# Altium schematic sheet ESP32_CONTROLLER_SHEET.SchDoc
size A4; SheetNumber: 4; SheetTotal: 8
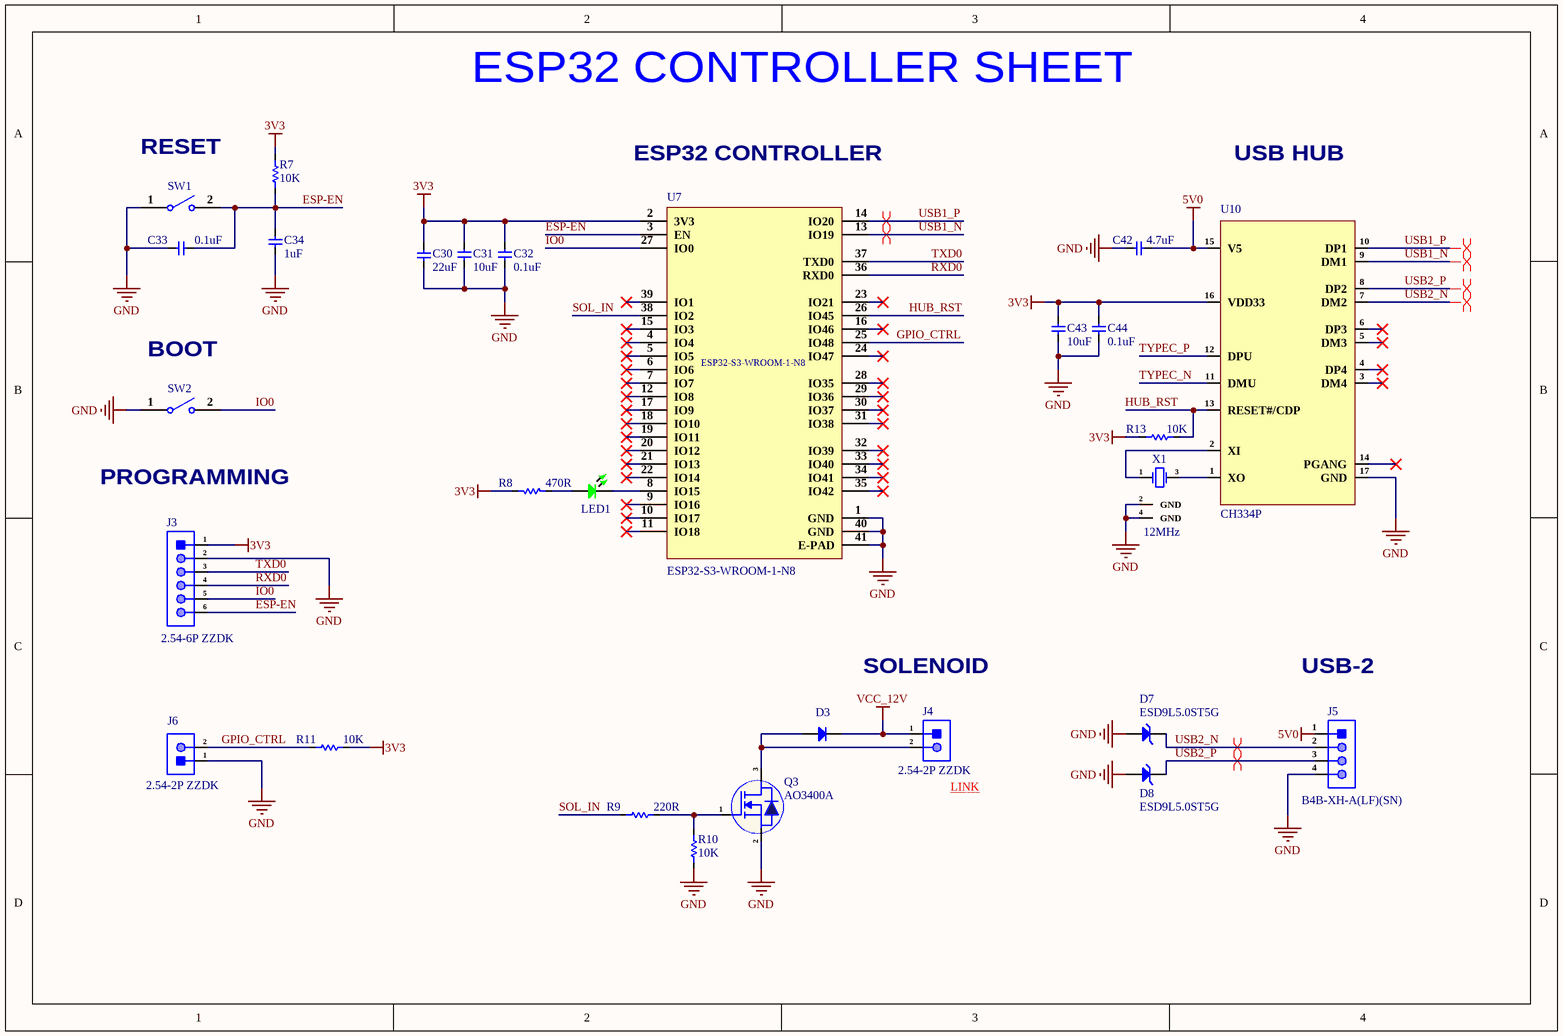
[diagram p0: ESP32_CONTROLLER_SHEET.SchDoc]

## Parts
C30  22uF  [Cap-0603]
C31  10uF  [Cap-0603]
C32  0.1uF  [Cap-0402]
C33  0.1uF  [Cap-0402]
C34  1uF  [Cap-0402]
C42  4.7uF  [Cap-0402]
C43  10uF  [Cap-0603]
C44  0.1uF  [Cap-0402]
D3  1N4148W  [SOD-123]  (value not drawn)
D7  ESD9L5.0ST5G  [SOD-923.]
D8  ESD9L5.0ST5G  [SOD-923.]
J3  2.54-6P ZZDK  [2.54-6P ZZDK]
J4  2.54-2P ZZDK  [2.54-2P ZZDK]
J5  B4B-XH-A(LF)(SN)  [B4B-XH-A(LF)(SN).]
J6  2.54-2P ZZDK  [2.54-2P ZZDK]
LED1  Emerald  [LED-0603]  (value not drawn)
Q3  AO3400A  [sot-23]
R7  10K  [Res-0402]
R8  470R  [Res-0402]
R9  220R  [Res-0402]
R10  10K  [Res-0402]
R11  10K  [Res-0402]
R13  10K  [Res-0402]
SW1  GT-TC032A-H015-L1  [GT-TC032A-H015-L1]  (value not drawn)
SW2  GT-TC032A-H015-L1  [GT-TC032A-H015-L1]  (value not drawn)
U7  ESP32-S3-WROOM-1-N8  [41-SMD Module]
U10  CH334P  [QFN-16]
X1  12MHz  [SMD2520-4P]

## Nets
3V3: C30.2 C31.1 C32.1 C43.1 C44.1 J3.1 R7.2 R8.2 R11.2 R13.2 U7.2(3V3) U10.16(VDD33)
5V0: C42.2 J5.1 U10.15(V5)
GND: C30.1 C31.2 C32.2 C33.2 C34.1 C42.1 C43.2 C44.2 D7.2(A) D8.2(A) J3.2 J5.4 J6.1 Q3.2(S) R10.1 SW1.1 SW2.1 U7.1(GND) U7.40(GND) U7.41(E-PAD) U10.17(GND) X1.2(GND) X1.4(GND)
VCC_12V: D3.2(K) J4.1
ESP-EN: C33.1 C34.2 J3.6 R7.1 SW1.2 U7.3(EN)
GPIO_CTRL: J6.2 R11.1 U7.25(IO48)
HUB_RST: R13.1 U7.26(IO45) U10.13(RESET#/CDP)
IO0: J3.5 SW2.2 U7.27(IO0)
RXD0: J3.4 U7.36(RXD0)
SOL_IN: R9.1 U7.38(IO2)
TXD0: J3.3 U7.37(TXD0)
TYPEC_N: U10.11(DMU)
TYPEC_P: U10.12(DPU)
USB1_N: U7.13(IO19) U10.9(DM1)
USB1_P: U7.14(IO20) U10.10(DP1)
USB2_N: D7.1(K) J5.2 U10.7(DM2)
USB2_P: D8.1(K) J5.3 U10.8(DP2)
NetD3_1: D3.1(A) J4.2 Q3.3(D)
NetLED1_1: LED1.1 R8.1
NetLED1_2: LED1.2 U7.8(IO15)
NetQ3_1: Q3.1(G) R9.2 R10.2
NetU10_1: U10.1(XO) X1.3(OSC2)
NetU10_2: U10.2(XI) X1.1(OSC1)

Not connected (* = marked no-connect by the designer): U7 4(IO4)* 5(IO5)* 6(IO6)* 7(IO7)* 9(IO16)* 10(IO17)* 11(IO18)* 12(IO8)* 15(IO3)* 16(IO46)* 17(IO9)* 18(IO10)* 19(IO11)* 20(IO12)* 21(IO13)* 22(IO14)* 23(IO21)* 24(IO47)* 28(IO35)* 29(IO36)* 30(IO37)* 31(IO38)* 32(IO39)* 33(IO40)* 34(IO41)* 35(IO42)* 39(IO1)*; U10 3(DM4)* 4(DP4)* 5(DM3)* 6(DP3)* 14(PGANG)*

## Layout directives
differential pair; differential pair class USB: USB1_N, USB1_P, USB2_N, USB2_P

## Notes on the sheet
- ESP32 CONTROLLER SHEET
- (near SW1) RESET
- ESP32 CONTROLLER
- USB HUB
- (near SW2) BOOT
- PROGRAMMING
- SOLENOID
- USB-2
- (near J4) LINK <https://www.digikey.com/en/products/detail/adafruit-industries-llc/5065/15189157?s=N4IgTCBcDaIM4FsCGAbFACAjGAauuA9igKYB2BAlgCYgC6AvkA>

## Library data of the parts
C30 = CC0603MRX5R6BB226: CAP CER 22UF 10V X5R 0603; Manufacturer: Yageo; Tolerance: 20%; Item Type: Capacitor; Supplier 1: Digi-Key; Manufacturer Part Number: CC0603MRX5R6BB226; RoHS: Yes; Category: Ceramic Capacitors; Stock 1: 19628; Pricing 1: 1=0.68000, 10=0.48000, 50=0.36300, 100=0.31610, 500=0.23416, 1000=0.19903 (USD); Mount: Surface Mount; Case/Package: 0603; Case Code (Metric): 1608; Case Code (Imperial): 0603; Weight: 7.1E-05oz; Min Operating Temperature: -55°C; Max Operating Temperature: 85°C; Packaging: Tape and Reel; Capacitance: 22uF; Voltage Rating: 10V; Dielectric: X5R; Termination: SMD/SMT; Voltage Rating (DC): 10V; Package Quantity: 4000; Length: 0.063inch; Width: 0.8mm; Height: 0.8mm; Thickness: 0.035inch; Lead Free: Lead Free; Halogen Free: Halogen Free; RoHS Compliant: Yes; ComponentLink1URL: http://www.mouser.com/ds/2/447/Yageo_UPY-GP_NP0_16V-to-50V_9-358835.pdf?src-supplier=Mouser; ComponentLink1Description: http://www.mouser.com/ds/2/447/Yageo_UPY-GP_NP0_16V-to-50V_9-358835.pdf?src-supplier=Mouser; ComponentLink2URL: http://www.yageo.com/documents/recent/UPY-GPHC_X5R_4V-to-50V_25.pdf?src-supplier=Digi-Key; ComponentLink2Description: http://www.yageo.com/documents/recent/UPY-GPHC_X5R_4V-to-50V_25.pdf?src-supplier=Digi-Key; Supplier Part Number 1: 311-1819-1-ND; LCSC Part Number: C109447
C31 C43 = CC0603KRX5R7BB106: CAP CER 10UF 16V X5R 0603; Manufacturer: Yageo; Tolerance: 10%; Item Type: Capacitor; Supplier 1: Digi-Key; Manufacturer Part Number: CC0603KRX5R7BB106; RoHS: Yes; Category: Ceramic Capacitors; Stock 1: 240725; Pricing 1: 1=0.68000, 10=0.48000, 50=0.36300, 100=0.31610, 500=0.23416, 1000=0.19903 (USD); Mount: Surface Mount; Case/Package: 0603; Case Code (Metric): 1608; Case Code (Imperial): 0603; Min Operating Temperature: -55°C; Max Operating Temperature: 85°C; Packaging: Cut Tape; Capacitance: 10uF; Voltage Rating: 16V; RoHS Compliant: Yes; ComponentLink1URL: http://www.yageo.com/documents/recent/UPY-GPHC_X5R_4V-to-50V_25.pdf?src-supplier=Digi-Key; ComponentLink1Description: http://www.yageo.com/documents/recent/UPY-GPHC_X5R_4V-to-50V_25.pdf?src-supplier=Digi-Key; Supplier Part Number 1: 311-3486-1-ND; LCSC Part Number: C2936601
C32 C33 C44 = CL05B104KB54PNC: CAP CER 0.1UF 50V X7R 0402; Manufacturer: Samsung; Supplier 1: Digi-Key; Manufacturer Part Number: CL05B104KB54PNC; Stock 1: 8594; Pricing 1: 1=0.1, 10=0.067, 50=0.0366, 100=0.0299, 500=0.02138, 1000=0.01681, 2500=0.01528, 5000=0.01406 (USD); Supplier Part Number 1: 1276-CL05B104KB54PNCDKR-ND; LCSC Part Number: C307331
C34 = CC0402KRX5R7BB105: CAP CER 1UF 16V X5R 0402; Manufacturer: Yageo; Tolerance: 10%; Item Type: Capacitor; Supplier 1: Digi-Key; Manufacturer Part Number: CC0402KRX5R7BB105; Stock 1: 1405667; Pricing 1: 1=0.36, 10=0.252, 100=0.1512, 500=0.1134, 1000=0.09576, 2500=0.09072, 5000=0.08568 (USD); Mount: Surface Mount; Case/Package: 0402; Weight: 2.3E-05oz; Case Code (Imperial): 0402; Case Code (Metric): 1005; Min Operating Temperature: -55°C; Max Operating Temperature: 85°C; Capacitance: 1uF; Dielectric: X5R; Packaging: Tape and Reel; Voltage Rating (DC): 16V; Voltage Rating: 16V; Termination: SMD/SMT; Composition: Ceramic; Length: 1mm; Height: 0.5mm; Width: 0.02inch; Thickness: 0.022inch; Depth: 0.5mm; Radiation Hardening: No; Lead Free: Lead Free; Halogen Free: Halogen Free; ComponentLink1URL: http://www.yageo.com/documents/recent/UPY-GPHC_X5R_4V-to-50V_12.pdf?src-supplier=Avnet+Europe; ComponentLink1Description: http://www.yageo.com/documents/recent/UPY-GPHC_X5R_4V-to-50V_12.pdf?src-supplier=Avnet+Europe; Supplier Part Number 1: 311-1691-6-ND; LCSC Part Number: C325464
C42 = CL05A475MO5NUNC: CAP CER 4.7UF 16V X5R 0402; Manufacturer: Samsung; Material: 4241ConductorMaterial; Tolerance: 20%; Supplier 1: Avnet; Manufacturer Part Number: CL05A475MO5NUNC; RoHS: Yes; Category: Ceramic Capacitors; Stock 1: 50000; Pricing 1: 10000=0.09712 (USD); Mount: Surface Mount; Case/Package: 0402; Case Code (Metric): 1005; Case Code (Imperial): 0402; Min Operating Temperature: -55°C; Max Operating Temperature: 85°C; Packaging: Cut Tape; Capacitance: 4.7uF; Voltage Rating: 16V; Series: CL; Voltage Rating (DC): 16V; Length: 0.039inch; Width: 0.02inch; Height: 550um; Thickness: 0.022inch; RoHS Compliant: Yes; ComponentLink1URL: http://www.farnell.com/datasheets/2710653.pdf?src-supplier=Farnell; ComponentLink1Description: http://www.farnell.com/datasheets/2710653.pdf?src-supplier=Farnell; ComponentLink2URL: http://www.samsungsem.com/kr/support/product-search/mlcc/CL05A475MO5NUNC.jsp?src-supplier=Digikey; ComponentLink2Description: http://www.samsungsem.com/kr/support/product-search/mlcc/CL05A475MO5NUNC.jsp?src-supplier=Digikey; ComponentLink3URL: http://www.farnell.com/datasheets/2710653.pdf?src-supplier=Element14; ComponentLink3Description: http://www.farnell.com/datasheets/2710653.pdf?src-supplier=Element14; ComponentLink4URL: https://datasheet.octopart.com/CL05A475MO5NUNC-Samsung-Electro-Mechanics-datasheet-123102911.pdf?src-supplier=Future+Electronics; ComponentLink4Description: https://datasheet.octopart.com/CL05A475MO5NUNC-Samsung-Electro-Mechanics-datasheet-123102911.pdf?src-supplier=Future+Electronics; ComponentLink5URL: http://www.farnell.com/datasheets/2710653.pdf?src-supplier=Newark; ComponentLink5Description: http://www.farnell.com/datasheets/2710653.pdf?src-supplier=Newark; Supplier Part Number 1: CL05A475MO5NUNC
D3 = 1N4148W: 100V 400mW Single 1.25V@150mA 8ns 300mA SOD-123 Switching Diode ROHS; Manufacturer: JSMSEMI; ComponentLink1Description: LCSC; ComponentLink1URL: https://www.lcsc.com/product-detail/Switching-Diode_JSMSEMI-1N4148W_C917030.html; Manufacturer Part Number: 1N4148W; Package: SOD-123; LCSC Part Number: C917030; Item Type: Diode
D7 = ESD9L5.0ST5G: Manufacturer: ON Semiconductor; Capacitance: 0.9pF; Direction: Unidirectional; Clamping Voltage: 9.8V; Number of Unidirectional Channels: 1; Reverse Standoff Voltage: 5V; Min Breakdown Voltage: 5.4V; Power Line Protection: No; Leakage Current: 1uA; Element Configuration: Single; Peak Pulse Current: 1A; Diode Type: ZENER; Reverse Breakdown Voltage: 5.8V; Peak Pulse Power: 150mW; ESD Protection: Yes; Test Current: 1mA; Supplier 1: Digi-Key; Manufacturer Part Number: ESD9L5.0ST5G; RoHS: Yes; Category: ESD and Circuit Protection ICs; Stock 1: 558996; Pricing 1: 1=0.37000, 10=0.25600, 100=0.12500, 500=0.10426, 1000=0.07244, 2000=0.06278 (USD); Case/Package: SOD-923-2; Number of Pins: 2; Contact Plating: Tin,Matte; Min Operating Temperature: -55°C; Max Operating Temperature: 150°C; Package Quantity: 1; Packaging: Tape and Reel; Working Voltage: 5V; Resistor Type: Zener; Series: Automotive, AEC-Q101; Number of Elements: 1; Operating Supply Voltage: 5V; Max Surge Current: 1A; Breakdown Voltage: 5.4V; Number of Channels: 1; Polarity: Unidirectional; Termination: SMD/SMT; Max Reverse Leakage Current: 1uA; Max Breakdown Voltage: 5.4V; Number of Lines: 1; Power Dissipation: 150mW; Clamping Voltage-Max: 9.8V; Length: 0.8mm; Width: 0.65mm; Height: 0.4mm; Depth: 0.6mm; Radiation Hardening: No; Lead Free: Lead Free; RoHS Compliant: Yes; REACH SVHC: No SVHC; Halogen Free: Halogen Free; ComponentLink1URL: https://datasheet.ciiva.com/15143/getdatasheetpartid-185186-15143896.pdf?src-supplier=Verical; ComponentLink1Description: https://datasheet.ciiva.com/15143/getdatasheetpartid-185186-15143896.pdf?src-supplier=Verical; ComponentLink2URL: https://datasheet.ciiva.com/4510/esd9l-d-4510647.pdf?src-supplier=Mouser; ComponentLink2Description: https://datasheet.ciiva.com/4510/esd9l-d-4510647.pdf?src-supplier=Mouser; ComponentLink3URL: https://datasheet.ciiva.com/3304/esd9l-d-3304011.pdf?src-supplier=Avnet; ComponentLink3Description: https://datasheet.ciiva.com/3304/esd9l-d-3304011.pdf?src-supplier=Avnet; ComponentLink4URL: https://datasheet.ciiva.com/16437/esd9l-d-16437835.pdf?src-supplier=Future+Electronics; ComponentLink4Description: https://datasheet.ciiva.com/16437/esd9l-d-16437835.pdf?src-supplier=Future+Electronics; ComponentLink5URL: https://datasheet.ciiva.com/339/esd9l-d-339853.pdf?src-supplier=Digi-Key; ComponentLink5Description: https://datasheet.ciiva.com/339/esd9l-d-339853.pdf?src-supplier=Digi-Key; ComponentLink6URL: https://datasheet.ciiva.com/339/esd9l-d-339854.pdf?src-supplier=Digi-Key; ComponentLink6Description: https://datasheet.ciiva.com/339/esd9l-d-339854.pdf?src-supplier=Digi-Key; ComponentLink7URL: https://datasheet.ciiva.com/11195/esd9l-d-11195342.pdf?src-supplier=Avnet; ComponentLink7Description: https://datasheet.ciiva.com/11195/esd9l-d-11195342.pdf?src-supplier=Avnet; ComponentLink8URL: https://datasheet.ciiva.com/25958/esd9l-d-25958446.pdf?src-supplier=Avnet+Europe; ComponentLink8Description: https://datasheet.ciiva.com/25958/esd9l-d-25958446.pdf?src-supplier=Avnet+Europe; ComponentLink9URL: https://datasheet.ciiva.com/339/esd9l-d-339855.pdf?src-supplier=Digi-Key; ComponentLink9Description: https://datasheet.ciiva.com/339/esd9l-d-339855.pdf?src-supplier=Digi-Key; Supplier Part Number 1: ESD9L5.0ST5GOSCT-ND; LCSC Part Number: C82326
D8 = ESD9L5.0ST5G: TVS DIODE 5V 9.8V SOD923; Manufacturer: ON Semiconductor; Capacitance: 0.9pF; Direction: Unidirectional; Number of Unidirectional Channels: 1; Min Breakdown Voltage: 5.4V; Power Line Protection: No; Leakage Current: 1uA; Element Configuration: Single; Peak Pulse Current: 1A; Diode Type: ZENER; Reverse Breakdown Voltage: 5.8V; Peak Pulse Power: 150mW; ESD Protection: Yes; Test Current: 1mA; Supplier 1: Digi-Key; Manufacturer Part Number: ESD9L5.0ST5G; RoHS: Yes; Category: ESD and Circuit Protection ICs; Stock 1: 558996; Pricing 1: 1=0.37000, 10=0.25600, 100=0.12500, 500=0.10426, 1000=0.07244, 2000=0.06278 (USD); Case/Package: SOD-923-2; Number of Pins: 2; Contact Plating: Tin,Matte; Min Operating Temperature: -55°C; Max Operating Temperature: 150°C; Package Quantity: 1; Packaging: Tape and Reel; Clamping Voltage: 9.8V; Reverse Standoff Voltage: 5V; Working Voltage: 5V; Resistor Type: Zener; Series: Automotive, AEC-Q101; Number of Elements: 1; Operating Supply Voltage: 5V; Max Surge Current: 1A; Breakdown Voltage: 5.4V; Number of Channels: 1; Polarity: Unidirectional; Termination: SMD/SMT; Max Reverse Leakage Current: 1uA; Max Breakdown Voltage: 5.4V; Number of Lines: 1; Power Dissipation: 150mW; Clamping Voltage-Max: 9.8V; Length: 0.8mm; Width: 0.65mm; Height: 0.4mm; Depth: 0.6mm; Radiation Hardening: No; Lead Free: Lead Free; RoHS Compliant: Yes; REACH SVHC: No SVHC; Halogen Free: Halogen Free; ComponentLink1URL: https://datasheet.ciiva.com/15143/getdatasheetpartid-185186-15143896.pdf?src-supplier=Verical; ComponentLink1Description: https://datasheet.ciiva.com/15143/getdatasheetpartid-185186-15143896.pdf?src-supplier=Verical; ComponentLink2URL: https://datasheet.ciiva.com/4510/esd9l-d-4510647.pdf?src-supplier=Mouser; ComponentLink2Description: https://datasheet.ciiva.com/4510/esd9l-d-4510647.pdf?src-supplier=Mouser; ComponentLink3URL: https://datasheet.ciiva.com/3304/esd9l-d-3304011.pdf?src-supplier=Avnet; ComponentLink3Description: https://datasheet.ciiva.com/3304/esd9l-d-3304011.pdf?src-supplier=Avnet; ComponentLink4URL: https://datasheet.ciiva.com/16437/esd9l-d-16437835.pdf?src-supplier=Future+Electronics; ComponentLink4Description: https://datasheet.ciiva.com/16437/esd9l-d-16437835.pdf?src-supplier=Future+Electronics; ComponentLink5URL: https://datasheet.ciiva.com/339/esd9l-d-339853.pdf?src-supplier=Digi-Key; ComponentLink5Description: https://datasheet.ciiva.com/339/esd9l-d-339853.pdf?src-supplier=Digi-Key; ComponentLink6URL: https://datasheet.ciiva.com/339/esd9l-d-339854.pdf?src-supplier=Digi-Key; ComponentLink6Description: https://datasheet.ciiva.com/339/esd9l-d-339854.pdf?src-supplier=Digi-Key; ComponentLink7URL: https://datasheet.ciiva.com/11195/esd9l-d-11195342.pdf?src-supplier=Avnet; ComponentLink7Description: https://datasheet.ciiva.com/11195/esd9l-d-11195342.pdf?src-supplier=Avnet; ComponentLink8URL: https://datasheet.ciiva.com/25958/esd9l-d-25958446.pdf?src-supplier=Avnet+Europe; ComponentLink8Description: https://datasheet.ciiva.com/25958/esd9l-d-25958446.pdf?src-supplier=Avnet+Europe; ComponentLink9URL: https://datasheet.ciiva.com/339/esd9l-d-339855.pdf?src-supplier=Digi-Key; ComponentLink9Description: https://datasheet.ciiva.com/339/esd9l-d-339855.pdf?src-supplier=Digi-Key; Supplier Part Number 1: ESD9L5.0ST5GOSCT-ND; LCSC Part Number: C82326
J3 = 2.54-6P ZZDK: CONN HEADER TH 6POS 2.5mm; Manufacturer: SHOU HAN; Manufacturer Part Number: 2.54-6P ZZDK; LCSC Part Number: C18185653
J4 J6 = 2.54-2P ZZDK: 1x2P 2P XH 1 2.5mm Tin 2 -25℃~+85℃ Brass 3A Direct Insert Plugin,P=2.5mm Wire To Board Connector ROHS; Manufacturer: SHOU HAN; Manufacturer Part Number: 2.54-2P ZZDK; Package: Plugin,P=2.5mm; LCSC Part Number: C18185649; Item Type: Wire To Board Connector; ComponentLink1Description: LCSC; ComponentLink1URL: https://www.lcsc.com/product-detail/Wire-To-Board-Connector_SHOU-HAN-2-54-2P-ZZDK_C18185649.html
J5 = B4B-XH-A(LF)(SN): CONN HEADER VERT 4POS 2.5MM; Manufacturer: JST; Current Rating: 3A; Gender: Male; Contact Resistance: 20mR; Voltage Rating (AC): 250V; Connector Type: Male Pin; Number of Positions: 4; Insulation Resistance: 1GR; Wire/Cable Gauge: 22AWG; Item Type: JST Connector; Supplier 1: Future Electronics; Manufacturer Part Number: B4B-XH-A(LF)(SN); RoHS: Yes; Category: FFC / FPC; Pricing 1: 1=0.13000, 300=0.11300, 1000=0.11000, 3000=0.10700, 10000=0.10400 (USD); Mount: Through Hole; Contact Material: Brass; Material: Polyamide; Contact Plating: Tin,Copper,Lead; Color: Natural; Housing Material: Polyamide; Housing Color: White; Min Operating Temperature: -25°C; Max Operating Temperature: 85°C; Number of Rows: 1; Max Current Rating: 3A; Package Quantity: 500; Packaging: Bulk; Voltage Rating: 250V; Termination: Press-Fit; Max Voltage Rating (AC): 250V; Max Voltage Rating (DC): 250V; Number of Contacts: 4; Orientation: Straight; Length: 12.4mm; Pitch: 2.5mm; Lead Pitch: 2.5mm; Depth: 5.75mm; REACH SVHC: No SVHC; Lead Free: Lead Free; ComponentLink1URL: https://datasheet.ciiva.com/26894/getdatasheetpartid-455616-26894787.pdf?src-supplier=Verical; ComponentLink1Description: https://datasheet.ciiva.com/26894/getdatasheetpartid-455616-26894787.pdf?src-supplier=Verical; ComponentLink2URL: https://datasheet.ciiva.com/26924/getdatasheetpartid-640571-26924035.pdf?src-supplier=Verical; ComponentLink2Description: https://datasheet.ciiva.com/26924/getdatasheetpartid-640571-26924035.pdf?src-supplier=Verical; ComponentLink3URL: https://datasheet.ciiva.com/16203/b4b-xh-alfsn-16203642.pdf?src-supplier=Future+Electronics; ComponentLink3Description: https://datasheet.ciiva.com/16203/b4b-xh-alfsn-16203642.pdf?src-supplier=Future+Electronics; ComponentLink4URL: https://datasheet.ciiva.com/726/exh-726404.pdf?src-supplier=Digi-Key; ComponentLink4Description: https://datasheet.ciiva.com/726/exh-726404.pdf?src-supplier=Digi-Key; Supplier Part Number 1: 8134090; LCSC Part Number: C144395
LED1 = NCD0603G2: Emerald 0603 Light Emitting Diodes (LED) ROHS; Manufacturer: Foshan NationStar Optoelectronics; Manufacturer Part Number: NCD0603G2; Package: 0603; LCSC Part Number: C87326; Item Type: LED; ComponentLink1Description: LCSC; ComponentLink1URL: https://www.lcsc.com/product-detail/Light-Emitting-Diodes-LED_Foshan-NationStar-Optoelectronics-NCD0603G2_C87326.html
Q3 = AO3400A: 30V 5.8A 32mΩ@10V,5.8A 1.4W 1.4V@250uA N Channel SOT-23 MOSFETs ROHS; Manufacturer: BORN; Item Type: Mosfet; ComponentLink1Description: LCSC; ComponentLink1URL: https://www.lcsc.com/product-detail/MOSFETs_BORN-AO3400A_C344010.html; Manufacturer Part Number: AO3400A; Footprint: SOT-23; LCSC Part Number: C344010
R7 R10 R11 R13 = RC0402FR-0710KL: RES 10K OHM 1% 1/16W 0402; Manufacturer: Yageo; Resistance: 10kR; Voltage Rating (DC): 50V; Temperature Coefficient: 100ppm/°C; Power Rating: 62.5mW; Max Power Dissipation: 63mW; Item Type: Resistor; Supplier 1: Mouser; Manufacturer Part Number: RC0402FR-0710KL; RoHS: Yes; Category: Chip SMD Resistors; Stock 1: 18648329; Pricing 1: 1=0.10000, 10=0.01400, 50=0.01400, 100=0.00500, 1000=0.00300, 10000=0.00200 (USD); Case/Package: 0402; Number of Pins: 2; Case Code (Imperial): 0402; Case Code (Metric): 1005; Min Operating Temperature: -55°C; Max Operating Temperature: 155°C; Resistor Type: Thick Film; Tolerance: 1%; Packaging: Tape and Reel; Voltage Rating: 50V; Termination: SMD/SMT; Working Voltage: 50V; Number of Terminations: 2; Features: Moisture Resistant; Series: RC; Resistance Tolerance: 1%; Construction: Rectangular; Length: 1mm; Width: 0.5mm; Height: 0.32mm; Depth: 0.5mm; Lead Pitch: 0.2mm; REACH SVHC: No SVHC; Lead Free: Lead Free; RoHS Compliant: Yes; Military Standard: Not; ComponentLink1URL: https://datasheet.ciiva.com/7660/38568-7660787.pdf?src-supplier=Element14; ComponentLink1Description: https://datasheet.ciiva.com/7660/38568-7660787.pdf?src-supplier=Element14; ComponentLink2URL: https://datasheet.ciiva.com/7849/1686128-7849814.pdf?src-supplier=Element14; ComponentLink2Description: https://datasheet.ciiva.com/7849/1686128-7849814.pdf?src-supplier=Element14; ComponentLink3URL: https://datasheet.ciiva.com/7983/1018594-7983486.pdf?src-supplier=Element14; ComponentLink3Description: https://datasheet.ciiva.com/7983/1018594-7983486.pdf?src-supplier=Element14; ComponentLink4URL: https://datasheet.ciiva.com/22747/1018594-22747512.pdf?src-supplier=Element14; ComponentLink4Description: https://datasheet.ciiva.com/22747/1018594-22747512.pdf?src-supplier=Element14; ComponentLink5URL: https://datasheet.ciiva.com/12667/pyu-rc0402-51-rohs-l-6-r-12667067.pdf?src-supplier=Mouser; ComponentLink5Description: https://datasheet.ciiva.com/12667/pyu-rc0402-51-rohs-l-6-r-12667067.pdf?src-supplier=Mouser; ComponentLink6URL: https://datasheet.ciiva.com/7849/1784430-7849813.pdf?src-supplier=Element14; ComponentLink6Description: https://datasheet.ciiva.com/7849/1784430-7849813.pdf?src-supplier=Element14; ComponentLink7URL: https://datasheet.ciiva.com/7849/1784430-7849815.pdf?src-supplier=Element14; ComponentLink7Description: https://datasheet.ciiva.com/7849/1784430-7849815.pdf?src-supplier=Element14; Supplier Part Number 1: 603-RC0402FR-0710KL; LCSC Part Number: C60490
R8 = RC0402FR-07470RL: RES 470 OHM 1% 1/16W 0402; Manufacturer: Yageo; Item Type: Resistor; Voltage Rating: 50V; Power Rating: 62.5mW; Temperature Coefficient: 100ppm/°C; Max Power Dissipation: 63mW; Supplier: Avnet; Supplier Part Number: RC0402FR-07470RL; Manufacturer Part Number: RC0402FR-07470RL; RoHS: Yes; Stock: 10000; Pricing: 10000=0.00085 (USD); Case/Package: 0402; Case Code (Metric): 1005; Case Code (Imperial): 0402; Min Operating Temperature: -55°C; Max Operating Temperature: 155°C; Packaging: Tape and Reel; Value: 470R; Tolerance: 1%; Number of Terminations: 2; Working Voltage: 50V; Package Quantity: 1; Resistor Type: Thick Film; Termination: SMD/SMT; Features: Moisture Resistant; Series: RC; Resistance Tolerance: 1%; Construction: Rectangular; Voltage Rating (AC): 50V; Length: 1mm; Width: 0.02inch; Height: 0.016inch; Depth: 0.5mm; Lead Free: Lead Free; Reach SVHC Compliant: No; RoHS Compliant: Yes; Military Standard: Not; ComponentLink1URL: https://datasheet.ciiva.com/46412/1018594-46412838.pdf?src-supplier=Element14; ComponentLink1Description: https://datasheet.ciiva.com/46412/1018594-46412838.pdf?src-supplier=Element14; ComponentLink2URL: https://datasheet.ciiva.com/2453/pyu-r-int-thick-7-2453377.pdf?src-supplier=Digikey; ComponentLink2Description: https://datasheet.ciiva.com/2453/pyu-r-int-thick-7-2453377.pdf?src-supplier=Digikey; ComponentLink3URL: https://datasheet.ciiva.com/2453/pyu-r-int-thick-7-2453378.pdf?src-supplier=Digikey; ComponentLink3Description: https://datasheet.ciiva.com/2453/pyu-r-int-thick-7-2453378.pdf?src-supplier=Digikey; ComponentLink4URL: https://datasheet.ciiva.com/2453/pyu-r-int-thick-7-2453376.pdf?src-supplier=Digikey; ComponentLink4Description: https://datasheet.ciiva.com/2453/pyu-r-int-thick-7-2453376.pdf?src-supplier=Digikey; ComponentLink5URL: https://datasheet.ciiva.com/7850/1018594-7850015.pdf?src-supplier=Element14; ComponentLink5Description: https://datasheet.ciiva.com/7850/1018594-7850015.pdf?src-supplier=Element14; ComponentLink6URL: https://datasheet.ciiva.com/7850/1018594-7850014.pdf?src-supplier=Element14; ComponentLink6Description: https://datasheet.ciiva.com/7850/1018594-7850014.pdf?src-supplier=Element14; ComponentLink7URL: https://datasheet.ciiva.com/15189/getdatasheetpartid-330246-15189463.pdf?src-supplier=Verical; ComponentLink7Description: https://datasheet.ciiva.com/15189/getdatasheetpartid-330246-15189463.pdf?src-supplier=Verical; LCSC Part Number: C114877
R9 = RC0402FR-07220RL: RES 220 OHM 1% 1/16W 0402; Manufacturer: Yageo; Item Type: Resistors; Power Rating: 62.5mW; Voltage Rating: 50V; Temperature Coefficient: 100ppm/°C; Max Power Dissipation: 63mW; Supplier: Digikey; LCSC Part Number: C112291; Manufacturer Part Number: RC0402FR-07220RL; RoHS: Yes; Stock: 225544; Pricing: 1=0.1, 10=0.007, 100=0.0061, 1000=0.0051, 2500=0.00408 (USD); Case/Package: 0402; Pins: 2; Case Code (Imperial): 0402; Case Code (Metric): 1005; Min Operating Temperature: -55°C; Max Operating Temperature: 155°C; Value: 220R; Tolerance: 1%; Packaging: Tape and Reel; Voltage Rating (DC): 50V; Package Quantity: 1; Termination: SMD/SMT; Resistor Type: Thick Film; Number of Terminations: 2; Features: Moisture Resistant; Series: RC; Resistance Tolerance: 1%; Construction: Rectangular; Technology: THICK FILM; Voltage Rating (AC): 50V; Length: 0.039inch; Width: 0.02inch; Height: 0.016inch; Depth: 0.5mm; Reach SVHC Compliant: No; Military Standard: Not; RoHS Compliant: Yes; Lead Free: 5697LeadFree; ComponentLink1URL: https://datasheet.ciiva.com/2453/pyu-r-int-thick-7-2453461.pdf?src-supplier=Digikey; ComponentLink1Description: https://datasheet.ciiva.com/2453/pyu-r-int-thick-7-2453461.pdf?src-supplier=Digikey
SW1 SW2 = GT-TC032A-H015-L1: None Without bracket 50mA 3.05mm 100000 Times 12V 160gf 2.5mm 1.5mm Round Button Standing paste SPST SMD Tactile Switches ROHS; Manufacturer: G-Switch; Item Type: Switch; Manufacturer Part Number: GT-TC032A-H015-L1; Package: SMD; LCSC Part Number: C843684; ComponentLink1Description: LCSC; ComponentLink1URL: https://www.lcsc.com/product-detail/Tactile-Switches_G-Switch-GT-TC032A-H015-L1_C843684.html?s_z=n_B3U-1000P
U7 = ESP32-S3-WROOM-1-N8: ESP32-S3 chip 2.4GHz SMD,18x25.5mm WiFi Modules ROHS; Manufacturer: Expressif System; Item Type: IC; Manufacturer Part Number: ESP32-S3-WROOM-1-N8; Package: SMD,18x25.5mm; LCSC Part Number: C2913198; ComponentLink1URL: https://www.lcsc.com/product-detail/WiFi-Modules_Espressif-Systems-ESP32-S3-WROOM-1-N8_C2913198.html; ComponentLink1Description: LCSC
U10 = CH334P: 480Mbps Hub USB 2.0 QFN-16(3x3) Interface Controllers RoHS; Manufacturer_Name: WCH; Manufacturer_Part_Number: CH334P; LCSC Part Number: C5373042
X1 = 2TJ412000XYGBC: 12MHz 18pF ±10ppm SMD2520-4P Crystals ROHS; Manufacturer: JYJE; Manufacturer Part Number: 2TJ412000XYGBC; Package: SMD2520-4P; LCSC Part Number: C2149207; Item Type: Crystal; ComponentLink1Description: LCSC; ComponentLink1URL: https://www.lcsc.com/product-detail/Crystals_JYJE-2TJ412000XYGBC_C2149207.html